# EAGLE schematic OpAmp-Inverting-3Transistor-alt (EAGLE 7.6.0)
Build an op amp with three discrete transistors Lyle Williams -December 01, 2011 http://www.edn.com/design/components-and-packaging/4368741/Build-an-op-amp-with-three-discrete-transistors
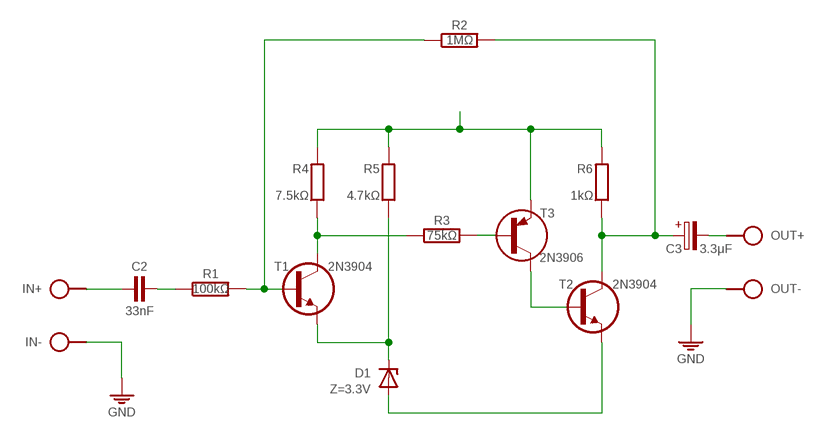
[diagram p0: schematic, sheet 1]

## Parts
C2  33nF  C050-020X044  [C050-020X044]
C3  3.3μF  CPOL-HE2,5-4/V  [E2.5-4/V]
D1  Z=3.3V  Z-DIODE34Z5V  [DO34Z5V]
IN  SPAD+--+  [SPAD-+]
OUT  SPAD+-+-  [SPAD+-]
R1  100kΩ  R-H0204/10  [0204/10]
R2  1MΩ  R-H0204/10  [0204/10]
R3  75kΩ  R-H0204/10-V  [0204/10-V]
R4  7.5kΩ  R0204/10-V  [0204/10-V]
R5  4.7kΩ  R0204/10-V  [0204/10-V]
R6  1kΩ  R0204/10-V  [0204/10-V]
T1  2N3904  2N3904EBC  [TO92-EBC]
T2  2N3904  2N3904EBC  [TO92-EBC]
T3  2N3906  2N3906TO92-EBC  [TO92-EBC]

## Nets
9V: R4.1 R5.1 R6.1 T3.E
GND: D1.A IN.1 OUT.1 T2.E
N$1: D1.C R5.2 T1.E
N$2: R3.1 R4.2 T1.C
N$3: T2.B T3.C
N$4: C2.2 IN.2
N$5: C2.1 R1.1
N$6: R1.2 R2.1 T1.B
N$7: R3.2 T3.B
N$8: C3.+ R2.2 R6.2 T2.C
N$9: C3.- OUT.2

## Library data of the parts
C2 = c:C: CAPACITOR, European symbol
C3 = c:CPOL-H
D1 = d:Z-DIODE
IN OUT = pad:SPAD+-
R1-R3 = r:R-H
R4-R6 = r:R: RESISTOR, European symbol
T1 T2 = t:2N3904
T3 = t:2N3906